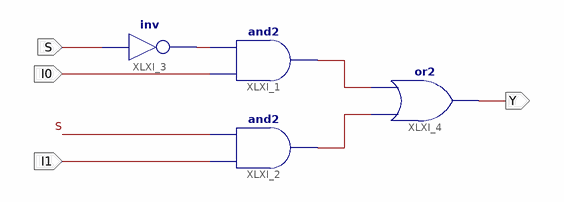
[diagram p0: schematic sheet 1]
// Xilinx ISE schematic multiplexer_2_to_1.sch (virtex6) as structural Verilog: 4 symbols, 4 ports
module multiplexer_2_to_1 (
  input  S,
  input  I0,
  input  I1,
  output Y
);

  wire XLXN_1, XLXN_6, XLXN_7;

  and XLXI_1 (XLXN_7, I0, XLXN_1);
  and XLXI_2 (XLXN_6, I1, S);
  not XLXI_3 (XLXN_1, S);
  or XLXI_4 (Y, XLXN_6, XLXN_7);
endmodule
